# Altium schematic sheet 10 SDMMC.SchDoc
size 420 x 297 mm; Address1: Address1; Address2: Address2; Address3: Address3; Address4: Address4; DocumentNumber: АБВГ.123456.001 Э3; SheetNumber: 10; SheetTotal: 23; Scale: 1:1; DocumentType: Схема электрическая принципиальная; FirstReferrence: АБВГ.123456.001
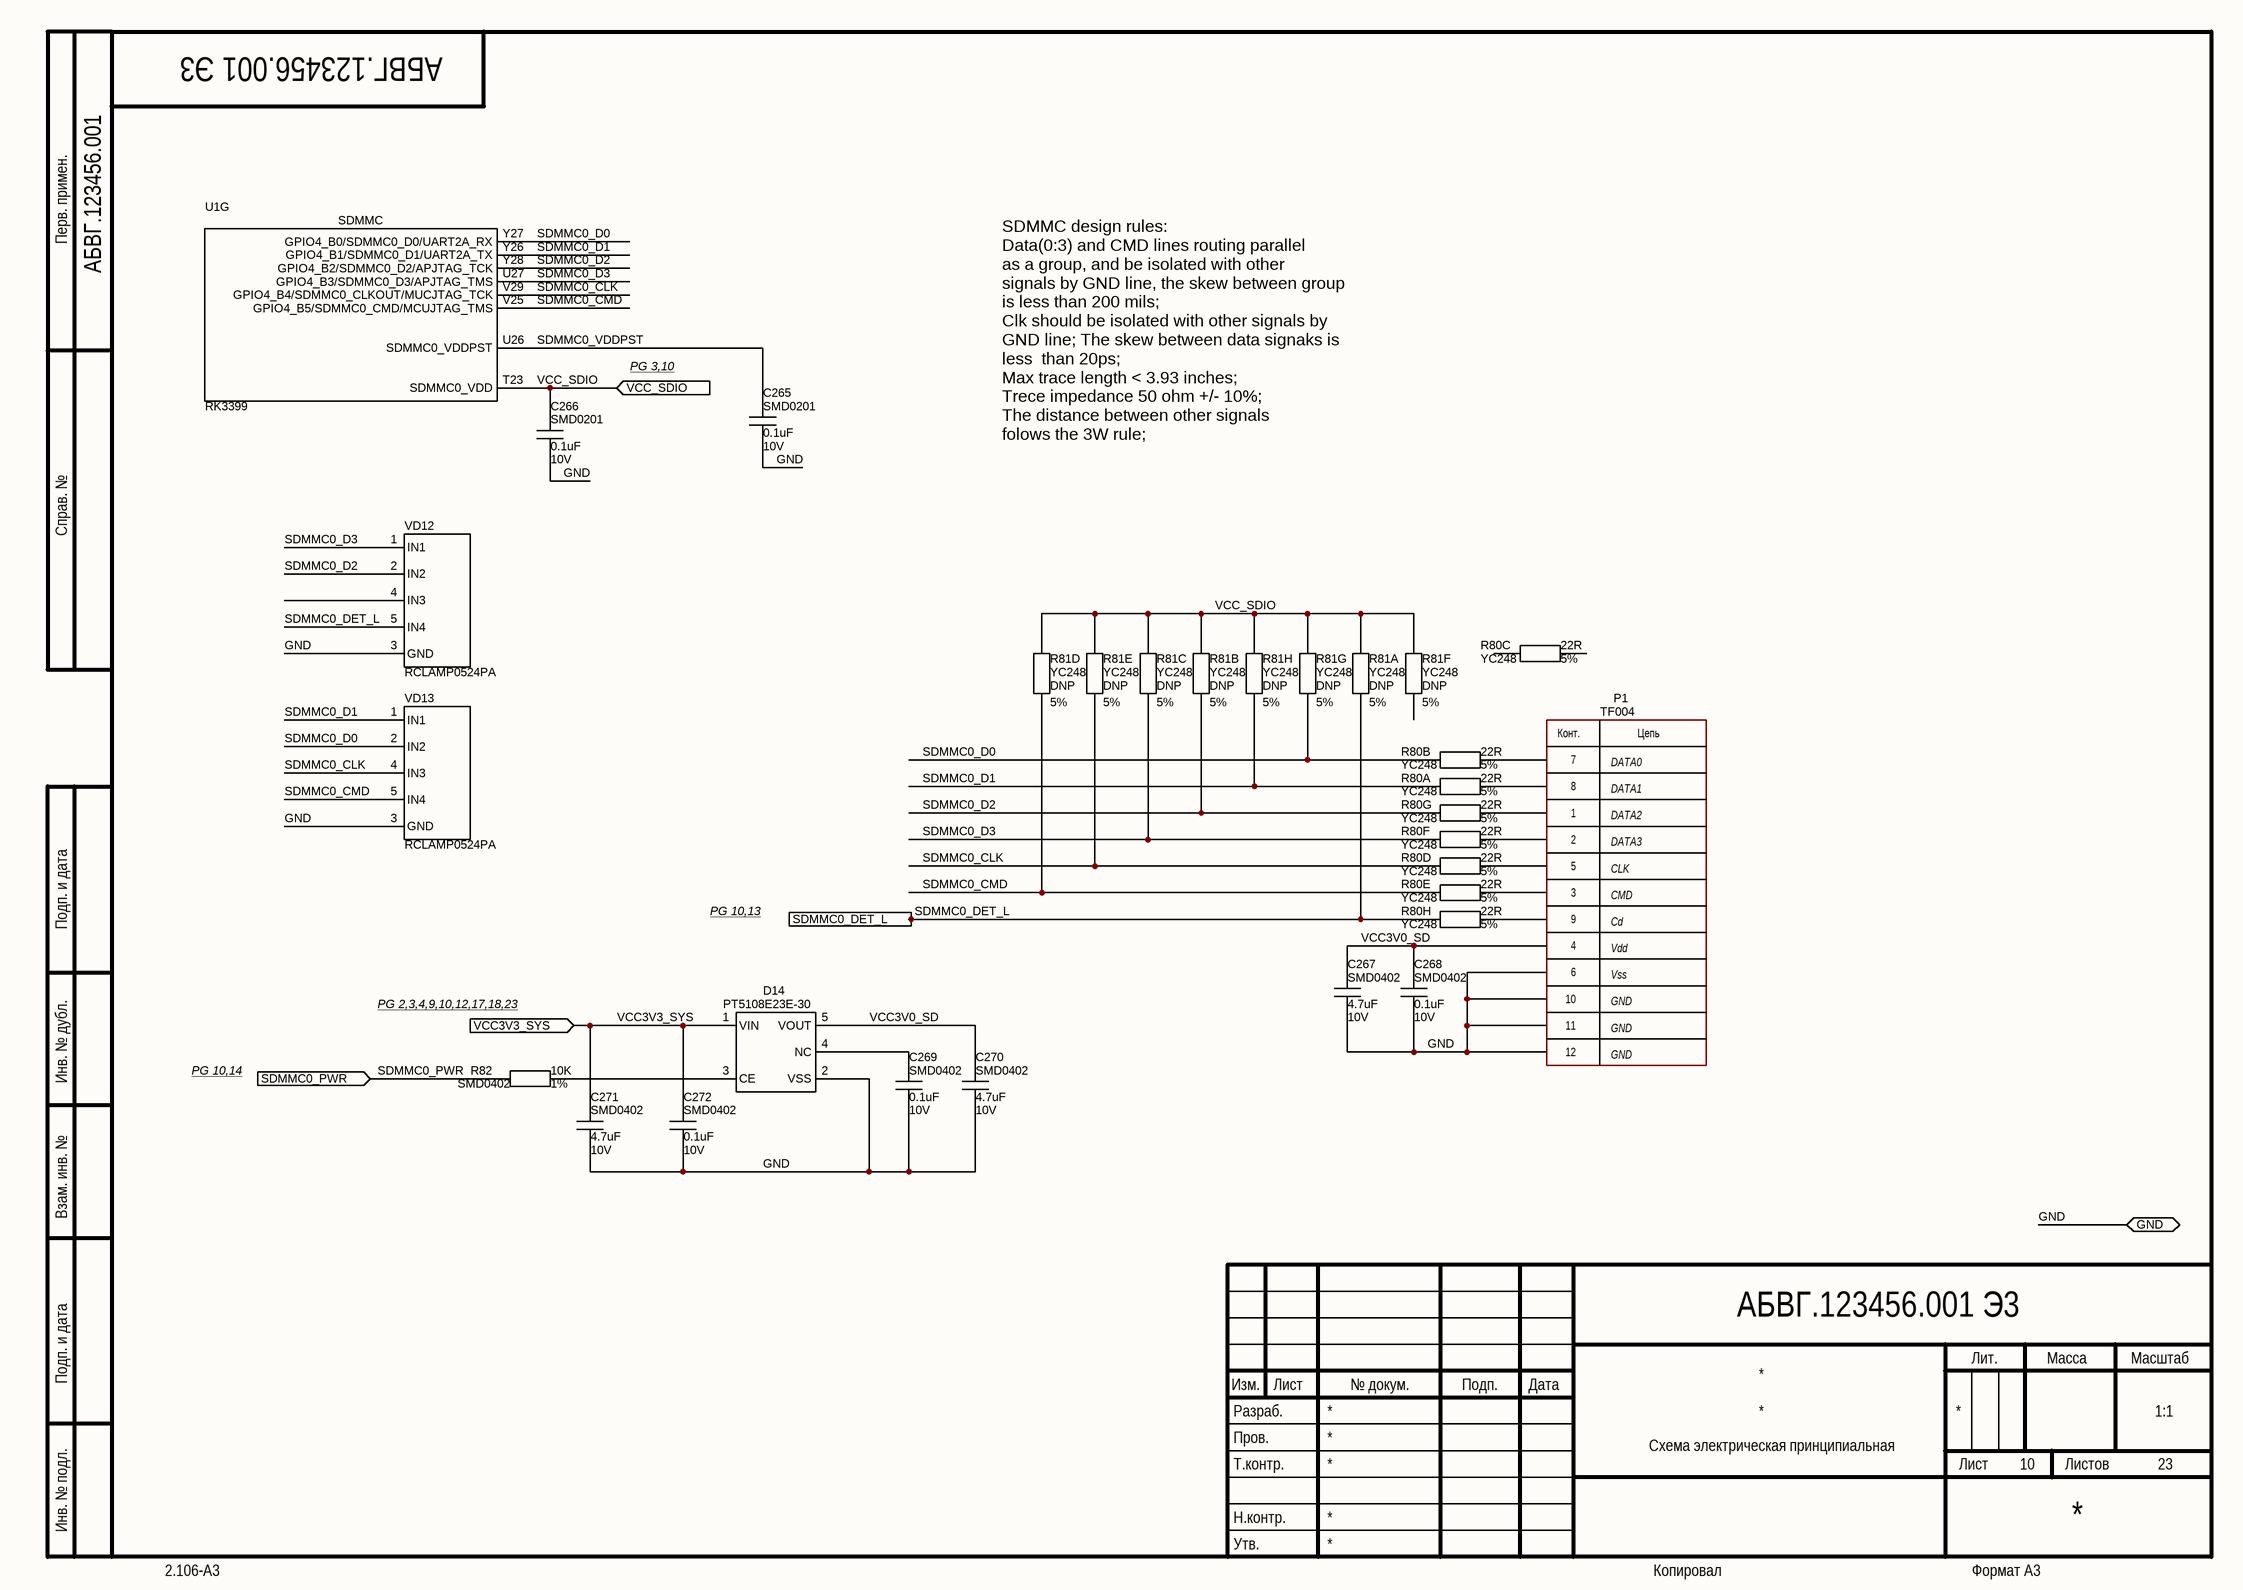
[diagram p0: 10 SDMMC.SchDoc]

## Parts
C265  Package: SMD0201  Voltage: 10V  [CAP_SMD_0201]  (hidden comment: 0.1uF)
C266  Package: SMD0201  Voltage: 10V  [CAP_SMD_0201]  (hidden comment: 0.1uF)
C267  Package: SMD0402  Voltage: 10V  [CAP_SMD_0402]  (hidden comment: 4.7uF)
C268  Package: SMD0402  Voltage: 10V  [CAP_SMD_0402]  (hidden comment: 0.1uF)
C269  Package: SMD0402  Voltage: 10V  [CAP_SMD_0402]  (hidden comment: 0.1uF)
C270  Package: SMD0402  Voltage: 10V  [CAP_SMD_0402]  (hidden comment: 4.7uF)
C271  Package: SMD0402  Voltage: 10V  [CAP_SMD_0402]  (hidden comment: 4.7uF)
C272  Package: SMD0402  Voltage: 10V  [CAP_SMD_0402]  (hidden comment: 0.1uF)
D14  PT5108E23E-30  [SOT23-5]
P1  TF004  [TF004]
R80  Tolerance: 5%  [YC248]  (hidden comment: 22R)  (parts A,B,C,D,E,F,G,H of 8)
R81  Tolerance: 5%  [YC248]  (hidden comment: DNP)  (parts A,B,C,D,E,F,G,H of 8)
R82  Package: SMD0402  Tolerance: 1%  [RES_SMD_0402]  (hidden comment: 10K)
U1  value RK3399  [BGA828C65P31X31_2100X2100X161N]  (hidden comment: RK3399_FF)  (part G of 23)
VD12  RCLAMP0524PA  [RCLAMP0524PA]
VD13  RCLAMP0524PA  [RCLAMP0524PA]

## Ports
GND (bidir), SDMMC0_DET_L (out), SDMMC0_PWR (in), VCC3V3_SYS (in), VCC_SDIO (in)

## Nets
GND: C265.2 C266.2 C267.1 C268.2 C269.2 C270.1 C271.1 C272.2 D14.2(VSS) P1.6 P1.10 P1.11 P1.12 VD12.3(GND) VD13.3(GND) ; port GND
SDMMC0_CLK: R80.13 R81.12 U1.V29(GPIO4_B4/SDMMC0_CLKOUT/MUCJTAG_TCK) VD13.4(IN3)
SDMMC0_CMD: R80.12 R81.13 U1.V25(GPIO4_B5/SDMMC0_CMD/MCUJTAG_TMS) VD13.5(IN4)
SDMMC0_D0: R80.15 R81.10 U1.Y27(GPIO4_B0/SDMMC0_D0/UART2A_RX) VD13.2(IN2)
SDMMC0_D1: R80.16 R81.9 U1.Y26(GPIO4_B1/SDMMC0_D1/UART2A_TX) VD13.1(IN1)
SDMMC0_D2: R80.10 R81.15 U1.Y28(GPIO4_B2/SDMMC0_D2/APJTAG_TCK) VD12.2(IN2)
SDMMC0_D3: R80.11 R81.14 U1.U27(GPIO4_B3/SDMMC0_D3/APJTAG_TMS) VD12.1(IN1)
SDMMC0_DET_L: R80.9 R81.16 VD12.5(IN4) ; port SDMMC0_DET_L
SDMMC0_PWR: R82.2 ; port SDMMC0_PWR
SDMMC0_VDDPST: C265.1 U1.U26(SDMMC0_VDDPST)
VCC3V0_SD: C267.2 C268.1 C270.2 D14.5(VOUT) P1.4
VCC3V3_SYS: C271.2 C272.1 D14.1(VIN) ; port VCC3V3_SYS
VCC_SDIO: C266.1 R81.1 R81.2 R81.3 R81.4 R81.5 R81.6 R81.7 R81.8 U1.T23(SDMMC0_VDD) ; port VCC_SDIO
NetC269_1: C269.1 D14.4(NC)
NetD14_3: D14.3(CE) R82.1
NetP1_1: P1.1 R80.7
NetP1_2: P1.2 R80.6
NetP1_3: P1.3 R80.5
NetP1_5: P1.5 R80.4
NetP1_7: P1.7 R80.2
NetP1_8: P1.8 R80.1
NetP1_9: P1.9 R80.8

Not connected (* = marked no-connect by the designer): R80 3 14; R81 11; VD12 4(IN3)

## Notes on the sheet
- Перв. примен.
- PG 3,10
- SDMMC design rules:
  Data(0:3) and CMD lines routing parallel
  as a group, and be isolated with other
  signals by GND line, the skew between group
  is less than 200 mils;
  Clk should be isolated with other signals by
  GND line; The skew between data signaks is
  less  than 20ps;
  Max trace length < 3.93 inches;
  Trece impedance 50 ohm +/- 10%;
  The distance between other signals
  folows the 3W rule;
- Справ. №
- Подп. и дата
- PG 10,13
- PG 2,3,4,9,10,12,17,18,23
- Инв. № дубл.
- PG 10,14
- Взам. инв. №
- Разраб.
- Изм.
- Лист
- № докум.
- Подп.
- Дата
- Лит.
- Масса
- Масштаб
- Пров.
- Т.контр.
- Листов
- Инв. № подл.
- Утв.
- Н.контр.
- 2.106-A3
- Копировал
- Формат А3
- (in symbol MicroSD 9E) Конт.; Цепь; DATA0; DATA1; DATA2; DATA3; CLK; CMD; Cd; Vdd; Vss; GND
- (in symbol RK3399_FF, part G) SDMMC

## Library data of the parts
C265 C266 = Ceramic_Cap: PartNumber: CC0201KRX5R6BB104; ComponentType: SMD Ceramic Chip Capacitor; Manufacter: *; Tolerance: *; ClassName: *; Value: 0.1uF
C267 C270 C271 = Ceramic_Cap: PartNumber: CL05A475KP5NRNC; ComponentType: SMD Ceramic Chip Capacitor; Manufacter: *; Tolerance: *; ClassName: *; Value: 4.7uF
C268 C269 C272 = Ceramic_Cap: PartNumber: CC0402KRX5R6BB104; ComponentType: SMD Ceramic Chip Capacitor; Manufacter: *; Tolerance: *; ClassName: *; Value: 0.1uF
P1 = MicroSD 9E: ComponentType: MicroSD conector; Manufacter: *; Package: TF004; PartNumber: TF004; Value: TF004
R80 = YC248: PartNumber: YC248-JR-0722RL; ComponentType: *; Manufacter: *; Package: YC248; ClassName: *; Value: 22R
R81 = YC248: PartNumber: Do Not Place; ComponentType: *; Manufacter: *; Package: YC248; ClassName: *; Value: DNP
R82 = Chip_Res: PartNumber: RC0402FR-0710KL; ComponentType: SMD Chip Resistor; Manufacter: *; Voltage: *; ClassName: *; Value: 10K
D14 = PT5108E23E-30: ComponentType: SMD Chip Resistor; Manufacter: *; Voltage: *; ClassName: *; Tolerance: *; PartNumber: PT5108E23E-30; Package: SOT23-5; Value: PT5108E23E-30
U1 = RK3399_FF: Package: BGA828; ComponentType: *; Manufacter: *; PartNumber: RK3399; ClassName: *
VD12 VD13 = RCLAMP0524PA: ComponentType: *; Manufacter: *; Package: RCLAMP0524PA; PartNumber: RCLAMP0524PA; ClassName: *; Value: RCLAMP0524PA